# EAGLE design Polarshield v2.4 (EAGLE 7.2.0)
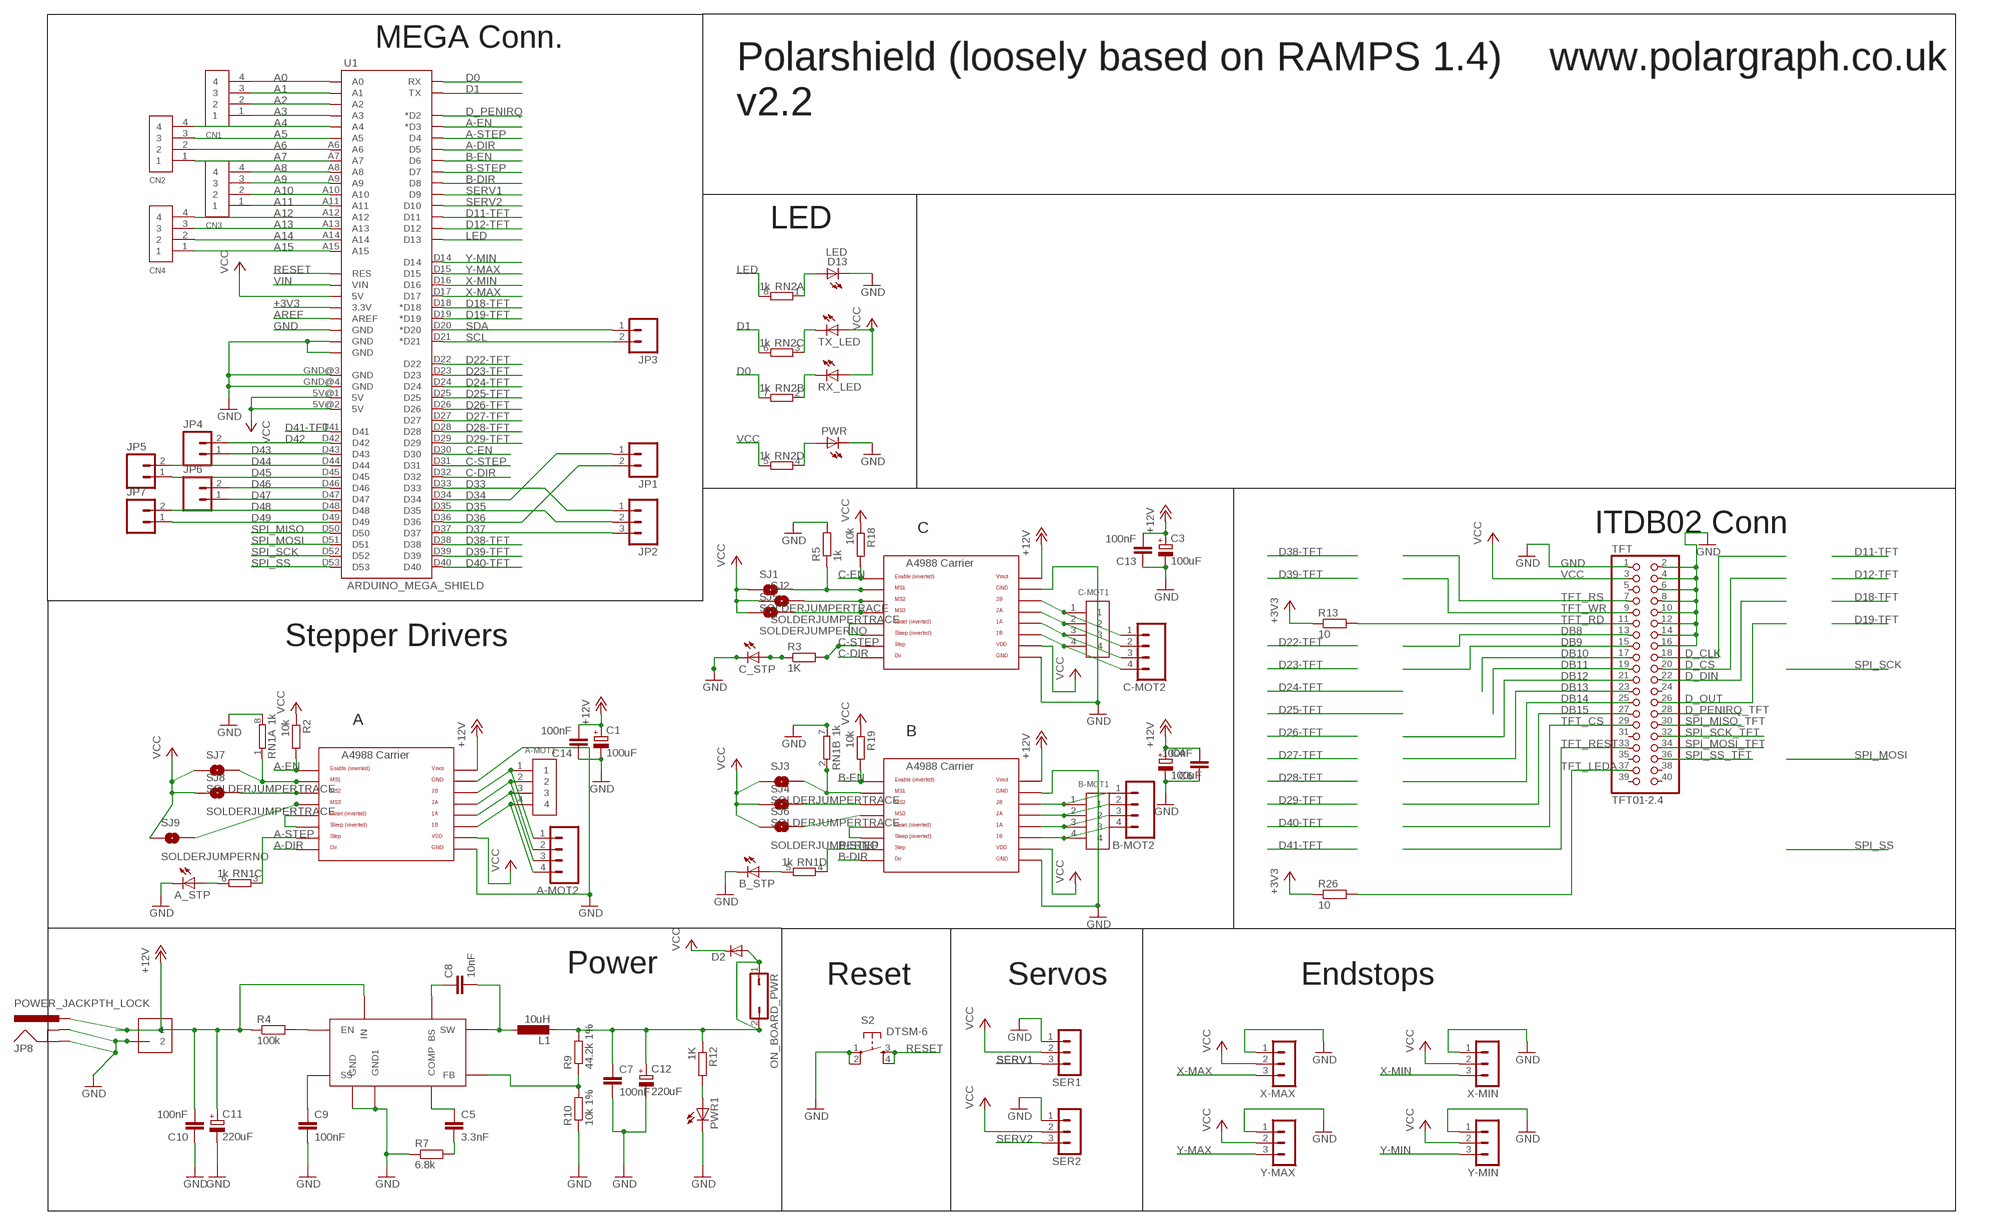
[diagram p0: schematic, sheet 1, part 1 of 2]
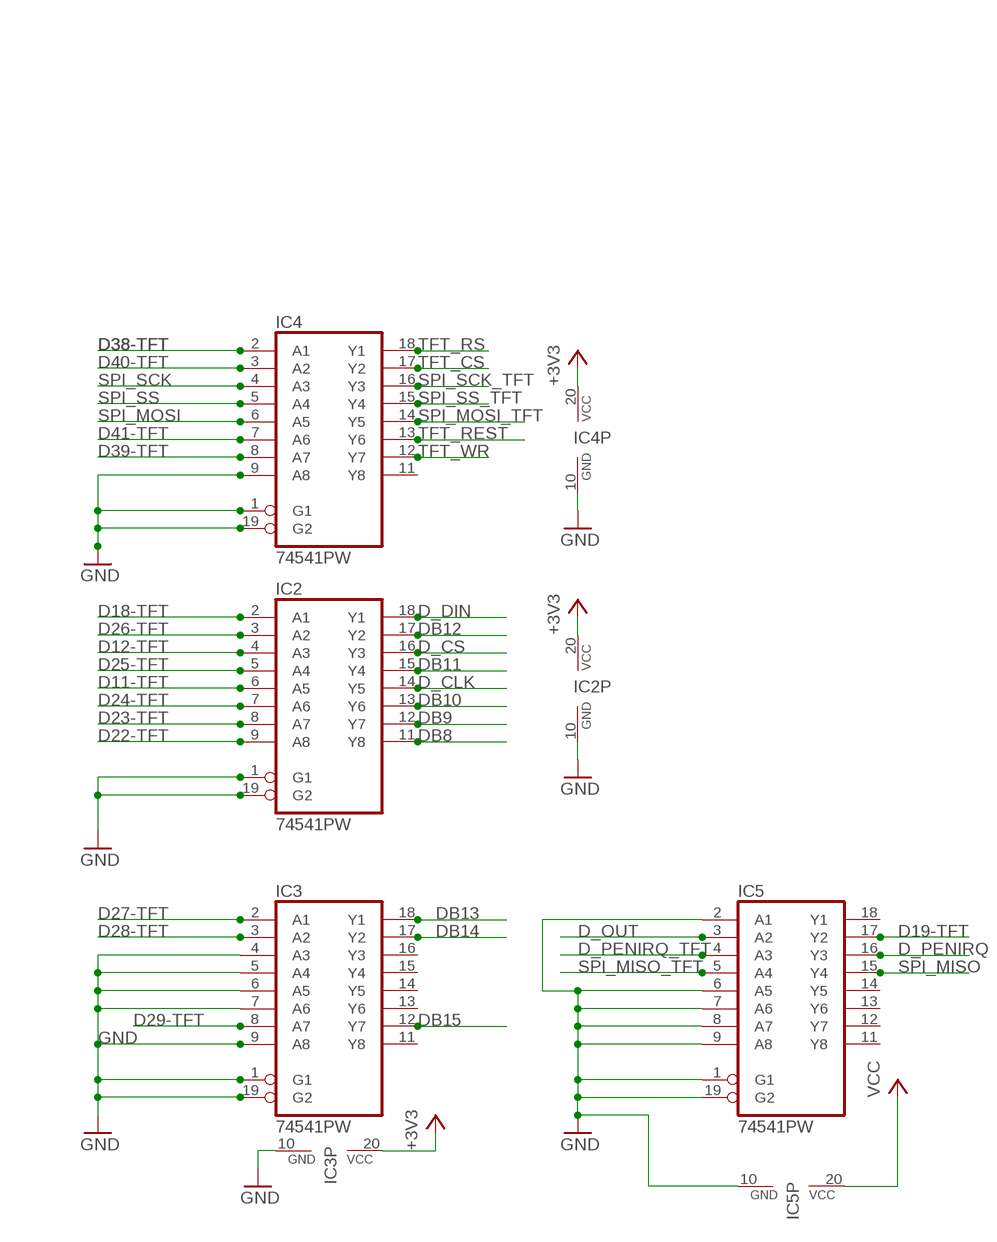
[diagram p1: schematic, sheet 1, part 2 of 2]

## Parts
A-MOT1  1X4-BIG  [1X04-BIG]
A-MOT2  M04SCREW  [SCREWTERMINAL-3.5MM-4]
A_STP  LEDCHIP-LED0805  [CHIP-LED0805]
B-MOT1  1X4-BIG  [1X04-BIG]
B-MOT2  M04SCREW  [SCREWTERMINAL-3.5MM-4]
B_STP  LEDCHIP-LED0805  [CHIP-LED0805]
C1  100uF  CPOL-EU153CLV-0605  [153CLV-0605]
C3  100uF  CPOL-EU153CLV-0605  [153CLV-0605]
C4  100uF  CPOL-EU153CLV-0605  [153CLV-0605]
C5  3.3nF  C-EUC0805K  [C0805K]
C6  100nF  C-EUC0805  [C0805]
C7  100nF  C-EUC0805K  [C0805K]
C8  10nF  C-EUC0805K  [C0805K]
C9  100nF  C-EUC0805K  [C0805K]
C10  100nF  C-EUC0805K  [C0805K]
C11  220uF  CPOL-EU153CLV-0807  [153CLV-0807]
C12  220uF  CPOL-EU153CLV-0807  [153CLV-0807]
C13  100nF  C-EUC0805  [C0805]
C14  100nF  C-EUC0805  [C0805]
C-MOT1  1X4-BIG  [1X04-BIG]
C-MOT2  M04SCREW  [SCREWTERMINAL-3.5MM-4]
C_STP  LEDCHIP-LED0805  [CHIP-LED0805]
CN1  1X4-CLEANBIG  [1X04-CLEANBIG]
CN2  1X4-CLEANBIG  [1X04-CLEANBIG]
CN3  1X4-CLEANBIG  [1X04-CLEANBIG]
CN4  1X4-CLEANBIG  [1X04-CLEANBIG]
D2  DIODE-DO214BA  [DO214BA]
D13  LED  LEDCHIP-LED0805  [CHIP-LED0805]
IC1  MP2307  [SOIC8]
IC2  74541PW  [TSSOP20]
IC3  74541PW  [TSSOP20]
IC4  74541PW  [TSSOP20]
IC5  74541PW  [TSSOP20]
J1  1X2-3.5MM  [1X2-3.5MM]
JP1  M021X02_NO_SILK  [1X02_NO_SILK]
JP2  M031X03_NO_SILK  [1X03_NO_SILK]
JP3  M021X02_NO_SILK  [1X02_NO_SILK]
JP4  M021X02_NO_SILK  [1X02_NO_SILK]
JP5  M021X02_NO_SILK  [1X02_NO_SILK]
JP6  M021X02_NO_SILK  [1X02_NO_SILK]
JP7  M021X02_NO_SILK  [1X02_NO_SILK]
JP8  POWER_JACKPTH_LOCK  [POWER_JACK_PTH_LOCK]
L1  10uH  L-EUPIS2816  [PIS2816]
ON_BOARD_PWR  JP1Q  [JP1]
PWR  LEDCHIP-LED0805  [CHIP-LED0805]
PWR1  LEDCHIP-LED0805  [CHIP-LED0805]
R2  10k  R-EU_R0805  [R0805]
R3  1K  R-EU_R0805  [R0805]
R4  100k  R-EU_R0805  [R0805]
R5  1k  R-EU_R0805  [R0805]
R7  6.8k  R-EU_R0805  [R0805]
R9  44.2k 1%  R-EU_R0805  [R0805]
R10  10k 1%  R-EU_R0805  [R0805]
R12  1K  R-EU_R0805  [R0805]
R13  10  R-EU_R0805  [R0805]
R18  10k  R-EU_R0805  [R0805]
R19  10k  R-EU_R0805  [R0805]
R26  10  R-EU_R0805  [R0805]
RN1  1k  4R-NEXBN8V  [EXBN8V]
RN2  1k  4R-NEXBN8V  [EXBN8V]
RX_LED  LEDCHIP-LED0805  [CHIP-LED0805]
S2  DTSM-6  [DTSM-6]
SER1  3PIN-HEADER  [3PIN-HEADER]
SER2  3PIN-HEADER  [3PIN-HEADER]
SJ1  SOLDERJUMPERTRACE  [SJ_2S-TRACE]
SJ2  SOLDERJUMPERTRACE  [SJ_2S-TRACE]
SJ3  SOLDERJUMPERTRACE  [SJ_2S-TRACE]
SJ4  SOLDERJUMPERTRACE  [SJ_2S-TRACE]
SJ5  SOLDERJUMPERNO  [SJ_2S-NO]
SJ6  SOLDERJUMPERNO  [SJ_2S-NO]
SJ7  SOLDERJUMPERTRACE  [SJ_2S-TRACE]
SJ8  SOLDERJUMPERTRACE  [SJ_2S-TRACE]
SJ9  SOLDERJUMPERNO  [SJ_2S-NO]
TFT  TFT01-2.4  [TFT01-2.4]
TX_LED  LEDCHIP-LED0805  [CHIP-LED0805]
U1  ARDUINO_MEGA_SHIELD  [ARDUINO_MEGA_SHIELD]
U$1  A4988BREAKOUT  [A4988BREAKOUT]
U$6  A4988BREAKOUT  [A4988BREAKOUT]
U$7  A4988BREAKOUT  [A4988BREAKOUT]
X-MAX  3PIN-HEADER  [3PIN-HEADER]
X-MIN  3PIN-HEADER  [3PIN-HEADER]
Y-MAX  3PIN-HEADER  [3PIN-HEADER]
Y-MIN  3PIN-HEADER  [3PIN-HEADER]

## Nets
+3V3: IC2.20(VCC) IC3.20(VCC) IC4.20(VCC) R13.1 R26.1 U1.3.3V
+12V [vmot]: C1.+ C3.+ C4.+ C6.2 C10.2 C11.+ C13.2 C14.2 IC1.IN J1.1 JP8.PWR R4.1 U$1.VMOT U$6.VMOT U$7.VMOT
A0: CN1.4 U1.A0
A1: CN1.3 U1.A1
A2: CN1.2 U1.A2
A3: CN1.1 U1.A3
A4: CN2.4 U1.A4
A5: CN2.3 U1.A5
A6: CN2.2 U1.A6
A7: CN2.1 U1.A7
A8: CN3.4 U1.A8
A9: CN3.3 U1.A9
A10: CN3.2 U1.A10
A11: CN3.1 U1.A11
A12: CN4.4 U1.A12
A13: CN4.3 U1.A13
A14: CN4.2 U1.A14
A15: CN4.1 U1.A15
A-DIR: U1.D5 U$1.DIR
A-EN: R2.2 U1.D3(*D3) U$1.EN
A-STEP: RN1.3 U1.D4 U$1.STEP
AREF: U1.AREF
B-DIR: U1.D8 U$7.DIR
B-EN: R19.2 U1.D6 U$7.EN
B-STEP: RN1.4 U1.D7 U$7.STEP
C-DIR: U1.D32 U$6.DIR
C-EN: R18.2 U1.D30 U$6.EN
C-STEP: R3.2 U1.D31 U$6.STEP
D0: RN2.7 U1.RX
D1: RN2.6 U1.TX
D11-TFT: IC2.6(A5) U1.D11
D12-TFT: IC2.4(A3) U1.D12
D18-TFT: IC2.2(A1) U1.D18(*D18)
D19-TFT [signal]: IC5.17(Y2) U1.D19(*D19)
D22-TFT: IC2.9(A8) U1.D22
D23-TFT: IC2.8(A7) U1.D23
D24-TFT: IC2.7(A6) U1.D24
D25-TFT: IC2.5(A4) U1.D25
D26-TFT: IC2.3(A2) U1.D26
D27-TFT: IC3.2(A1) U1.D27
D28-TFT: IC3.3(A2) U1.D28
D29-TFT: IC3.8(A7) U1.D29
D33: JP2.1 U1.D33
D34: JP1.1 U1.D34
D35: JP2.2 U1.D35
D36: JP1.2 U1.D36
D37: JP2.3 U1.D37
D38-TFT: IC4.2(A1) U1.D38
D39-TFT: IC4.8(A7) U1.D39
D40-TFT: IC4.3(A2) U1.D40
D41-TFT: IC4.7(A6) U1.D41
D42: JP4.2 U1.D42
D43: JP4.1 U1.D43
D44: JP5.2 U1.D44
D45: JP5.1 U1.D45
D46: JP6.2 U1.D46
D47: JP6.1 U1.D47
D48: JP7.2 U1.D48
D49: JP7.1 U1.D49
D_CLK: IC2.14(Y5) TFT.18
D_CS: IC2.16(Y3) TFT.20
D_DIN: IC2.18(Y1) TFT.22
D_OUT: IC5.3(A2) TFT.26
D_PENIRQ: IC5.16(Y3) U1.D2(*D2)
D_PENIRQ_TFT: IC5.4(A3) TFT.28
DB8: IC2.11(Y8) TFT.13
DB9: IC2.12(Y7) TFT.15
DB10: IC2.13(Y6) TFT.17
DB11: IC2.15(Y4) TFT.19
DB12: IC2.17(Y2) TFT.21
DB13: IC3.18(Y1) TFT.23
DB14: IC3.17(Y2) TFT.25
DB15: IC3.12(Y7) TFT.27
GND [gnd5]: A_STP.C B_STP.C C1.- C3.- C4.- C6.1 C7.2 C9.2 C10.1 C11.- C12.- C13.1 C14.1 C_STP.C D13.C IC1.GND IC1.GND1 IC2.1(G1) IC2.10(GND) IC2.19(G2) IC3.1(G1) IC3.4(A3) IC3.5(A4) IC3.6(A5) IC3.7(A6) IC3.9(A8) IC3.10(GND) IC3.19(G2) IC4.1(G1) IC4.9(A8) IC4.10(GND) IC4.19(G2) IC5.1(G1) IC5.2(A1) IC5.6(A5) IC5.7(A6) IC5.8(A7) IC5.9(A8) IC5.10(GND) IC5.19(G2) J1.2 JP8.GND JP8.GNDBREAK PWR1.C PWR.C R5.2 R7.1 R10.1 RN1.7 RN1.8 S2.1 S2.2 SER1.1 SER2.1 TFT.1 TFT.2 TFT.4 TFT.6 TFT.8 TFT.10 TFT.12 TFT.14 TFT.16 U1.GND@0(GND) U1.GND@1(GND) U1.GND@2(GND) U1.GND@3(GND) U1.GND@4(GND) U$1.GND U$1.GND@0(GND) U$6.GND U$6.GND@0(GND) U$7.GND U$7.GND@0(GND) X-MAX.1 X-MIN.1 Y-MAX.1 Y-MIN.1
LED: RN2.8 U1.D13
N$1: U$6.RST U$6.SLP(SLEEP)
N$2: PWR.A RN2.4
N$3: R5.1 SJ1.2 U$6.MS1
N$4: A-MOT1.1 A-MOT2.1 U$1.2B
N$5 [vmot]: A-MOT1.2 A-MOT2.2 U$1.2A
N$6 [vmot]: A-MOT1.3 A-MOT2.3 U$1.1A
N$7: A-MOT1.4 A-MOT2.4 U$1.1B
N$8: U$1.RST U$1.SLP(SLEEP)
N$9: RN1.1 SJ7.2 U$1.MS1
N$10: SJ2.2 U$6.MS2
N$11: SJ8.2 U$1.MS2
N$12: SJ5.2 U$6.MS3
N$13: U$7.RST U$7.SLP(SLEEP)
N$14: SJ9.2 U$1.MS3
N$15: RN2.2 RX_LED.C
N$16: RN2.3 TX_LED.C
N$17: SJ4.2 U$7.MS2
N$18: B_STP.A RN1.5
N$19: A_STP.A RN1.6
N$20: D13.A RN2.1
N$21: C-MOT1.1 C-MOT2.1 U$6.2B
N$22: C-MOT1.2 C-MOT2.2 U$6.2A
N$23: C_STP.A R3.1
N$24: C7.1 C12.+ D2.A L1.2 ON_BOARD_PWR.1 ON_BOARD_PWR.2 R9.2 R12.1
N$25: PWR1.A R12.2
N$26: C-MOT1.3 C-MOT2.3 U$6.1A
N$27: C-MOT1.4 C-MOT2.4 U$6.1B
N$28: B-MOT1.1 B-MOT2.1 U$7.2B
N$29: B-MOT1.2 B-MOT2.2 U$7.2A
N$30: B-MOT1.3 B-MOT2.3 U$7.1A
N$31: SJ6.2 U$7.MS3
N$32: IC1.FB R9.1 R10.2
N$33: RN1.2 SJ3.2 U$7.MS1
N$34: IC1.EN R4.2
N$36: B-MOT1.4 B-MOT2.4 U$7.1B
N$38: C9.1 IC1.SS
N$40: C5.2 R7.2
N$42: C5.1 IC1.COMP
N$43: C8.1 IC1.BS
N$44: C8.2 IC1.SW L1.1
RESET: S2.3 S2.4 U1.RES
SCL: JP3.2 U1.D21(*D21)
SDA: JP3.1 U1.D20(*D20)
SERV1: SER1.3 U1.D9
SERV2: SER2.3 U1.D10
SPI_MISO: IC5.15(Y4) U1.D50
SPI_MISO_TFT: IC5.5(A4) TFT.30
SPI_MOSI: IC4.6(A5) U1.D51
SPI_MOSI_TFT: IC4.14(Y5) TFT.34
SPI_SCK: IC4.4(A3) U1.D52
SPI_SCK_TFT: IC4.16(Y3) TFT.32
SPI_SS: IC4.5(A4) U1.D53
SPI_SS_TFT: IC4.15(Y4) TFT.36
TFT_CS: IC4.17(Y2) TFT.29
TFT_LEDA: R26.2 TFT.37
TFT_RD: R13.2 TFT.11
TFT_REST: IC4.13(Y6) TFT.33
TFT_RS: IC4.18(Y1) TFT.7
TFT_WR: IC4.12(Y7) TFT.9
VCC: D2.C IC5.20(VCC) R2.1 R18.1 R19.1 RN2.5 RX_LED.A SER1.2 SER2.2 SJ1.1 SJ2.1 SJ3.1 SJ4.1 SJ5.1 SJ6.1 SJ7.1 SJ8.1 SJ9.1 TFT.3 TX_LED.A U1.5V@0(5V) U1.5V@1(5V) U1.5V@2(5V) U$1.VDD U$6.VDD U$7.VDD X-MAX.2 X-MIN.2 Y-MAX.2 Y-MIN.2
VIN [vcc]: U1.VIN
X-MAX: U1.D17 X-MAX.3
X-MIN: U1.D16 X-MIN.3
Y-MAX: U1.D15 Y-MAX.3
Y-MIN: U1.D14 Y-MIN.3
Unconnected: IC3.11(Y8) IC3.13(Y6) IC3.14(Y5) IC3.15(Y4) IC3.16(Y3) IC4.11(Y8) IC5.11(Y8) IC5.12(Y7) IC5.13(Y6) IC5.14(Y5) IC5.18(Y1) TFT.5 TFT.24 TFT.31 TFT.35 TFT.38 TFT.39 TFT.40

## Notes on the sheet
- MEGA Conn.
- Polarshield (loosely based on RAMPS 1.4) | www.polargraph.co.uk
- v2.2
- LED
- C | ITDB02 Conn
- Stepper Drivers
- A
- B
- Power
- Reset | Servos | Endstops

## Library data of the parts
A-MOT1 B-MOT1 C-MOT1 = adafruit:1X4: 4-pin connector
A-MOT2 B-MOT2 C-MOT2 = Polarshield v2.0e:M04: Header 4 Standard 4-pin 0.1" header. Use with straight break away headers (SKU : PRT-00116), right angle break away headers (PRT-00553), swiss pins (PRT-00743), machine pins (PRT-00117), and female headers (PRT-00115). Molex polarized connector foot print use with SKU : PRT-08231 with associated crimp pins and housings. 1MM SMD Version SKU: PRT-10208
A_STP B_STP C_STP D13 PWR PWR1 RX_LED TX_LED = led:LED: LED OSRAM: - CHIPLED LG R971, LG N971, LY N971, LG Q971, LY Q971, LO R971, LY R971 LH N974, LH R974 LS Q976, LO Q976, LY Q976 LO Q996 - Hyper CHIPLED LW Q18S LB Q993, LB Q99A, LB R99A - SideLED LS A670, LO A670, LY A670, LG A670, LP A670 LB A673, LV A673, LT A673, LW A673 LH A674 LY A675 LS A676, LA A676, LO A676, LY A676, LW A676 LS A679, LY A679, LG A679 - Hyper Micro SIDELED® LS Y876, LA Y876, LO Y876, LY Y876 LT Y87S - SmartLED LW L88C, LW L88S LB L89C, LB L89S, LG L890 LS L89K, LO L89K, LY L89K LS L896, LA L896, LO L896, LY L896 - TOPLED LS T670, LO T670, LY T670, LG T670, LP T670 LSG T670, LSP T670, LSY T670, LOP T670, LYG T670 LG T671, LOG T671, LSG T671 LB T673, LV T673, LT T673, LW T673 LH T674 LS T676, LA T676, LO T676, LY T676, LB T676, LH T676, LSB T676, LW T676 LB T67C, LV T67C, LT T67C, LS T67K, LO T67K, LY T67K, LW E67C LS E67B, LA E67B, LO E67B, LY E67B, LB E67C, LV E67C, LT E67C LW T67C LS T679, LY T679, LG T679 LS T770, LO T770, LY T770, LG T770, LP T770 LB T773, LV T773, LT T773, LW T773 LH T774 LS E675, LA E675, LY E675, LS T675 LS T776, LA T776, LO T776, LY T776, LB T776 LHGB T686 LT T68C, LB T68C - Hyper Mini TOPLED® LB M676 - Mini TOPLED Santana® LG M470 LS M47K, LO M47K, LY M47K Source: http://www.osram.convergy.de LUXEON: - LUMILED® LXK2-PW12-R00, LXK2-PW12-S00, LXK2-PW14-U00, LXK2-PW14-V00 LXK2-PM12-R00, LXK2-PM12-S00, LXK2-PM14-U00 LXK2-PE12-Q00, LXK2-PE12-R00, LXK2-PE12-S00, LXK2-PE14-T00, LXK2-PE14-U00 LXK2-PB12-K00, LXK2-PB12-L00, LXK2-PB12-M00, LXK2-PB14-N00, LXK2-PB14-P00, LXK2-PB14-Q00 LXK2-PR12-L00, LXK2-PR12-M00, LXK2-PR14-Q00, LXK2-PR14-R00 LXK2-PD12-Q00, LXK2-PD12-R00, LXK2-PD12-S00 LXK2-PH12-R00, LXK2-PH12-S00 LXK2-PL12-P00, LXK2-PL12-Q00, LXK2-PL12-R00 Source: www.luxeon.com KINGBRIGHT: KA-3528ASYC Source: www.kingbright.com
C1 C3 C4 = rcl:CPOL-EU: POLARIZED CAPACITOR, European symbol
C5-C10 C13 C14 = resistor:C-EU: CAPACITOR, European symbol
C11 C12 = resistor:CPOL-EU: POLARIZED CAPACITOR, European symbol
CN1-CN4 = Polarshield v2.0e:1X4: 4-pin connector
D2 = diode:DIODE-: DIODE
IC1 = sandy:MP2307
IC2-IC5 = 74xx-eu:74*541: Octal BUFFER and LINE DRIVER, 3-state
J1 = adafruit:1X2: 3.5mm Terminal block http://www.ladyada.net/library/pcb/eaglelibrary.html
JP1 JP3-JP7 = SparkFun-Connectors:M02: Standard 2-pin 0.1" header. Use with - straight break away headers ( PRT-00116) - right angle break away headers (PRT-00553) - swiss pins (PRT-00743) - machine pins (PRT-00117) - female headers (PRT-00115) Molex polarized connector foot print use with: PRT-08233 with associated crimp pins and housings. 2.54_SCREWTERM for use with PRT-10571. 3.5mm Screw Terminal footprints for PRT-08084 5mm Screw Terminal footprints for use with PRT-08432
JP2 = SparkFun-Connectors:M03: Header 3 Standard 3-pin 0.1" header. Use with straight break away headers (SKU : PRT-00116), right angle break away headers (PRT-00553), swiss pins (PRT-00743), machine pins (PRT-00117), and female headers (PRT-00115). Molex polarized connector foot print use with SKU : PRT-08232 with associated crimp pins and housings.
JP8 = SparkFun-Connectors:POWER_JACK: Power Jack This is the standard 5.5mm barrel jack for power. The PTH is the most common, proven, reliable, footprint. The Slot footprint only works if the mill layer is transmitted to the PCB fab house so be warned. Mating wall wart : TOL-00298 (and others); PROD_ID: CONN-08197; SF_ID: PRT-00119
L1 = rcl:L-EU: INDUCTOR, European symbol
ON_BOARD_PWR = jumper:JP1Q: JUMPER
R2 R3 R5 R12 R18 R19 = rcl:R-EU_: RESISTOR, European symbol
R4 R7 R9 R10 R13 R26 = resistor:R-EU_: RESISTOR, European symbol
RN1 RN2 = resistor-dil:4R-N: Array Chip Resistor Source: RS Component / Phycomp; OC_FARNELL: unknown; OC_NEWARK: unknown
S2 = switch-tact:DTSM-6
SER1 SER2 X-MAX X-MIN Y-MAX Y-MIN = ultimachine:3PIN-HEADER: PIN HEADER
SJ1-SJ9 = SparkFun:SOLDERJUMPER: Solder Jumper Standard SMD solder jumper. Used to automate production. Two varients : Normally Open and Normally Closed are the same, but have different paste layers. NC will have a large amount of paste and should jumper during reflow.
TFT = Polarshield v2.0e:TFT01-2.4
U1 = Polarshield v2.0e:ARDUINO_MEGA_SHIELD
U$1 U$6 U$7 = RepRapjr:A4988BREAKOUT

## Net classes
0 default: width 0.406 mm
1 gnd12: width 1.422 mm
2 gnd5: width 1.422 mm
3 vmot: width 1.422 mm
4 vcc: width 0.61 mm
5 signal: width 0.406 mm

## Board
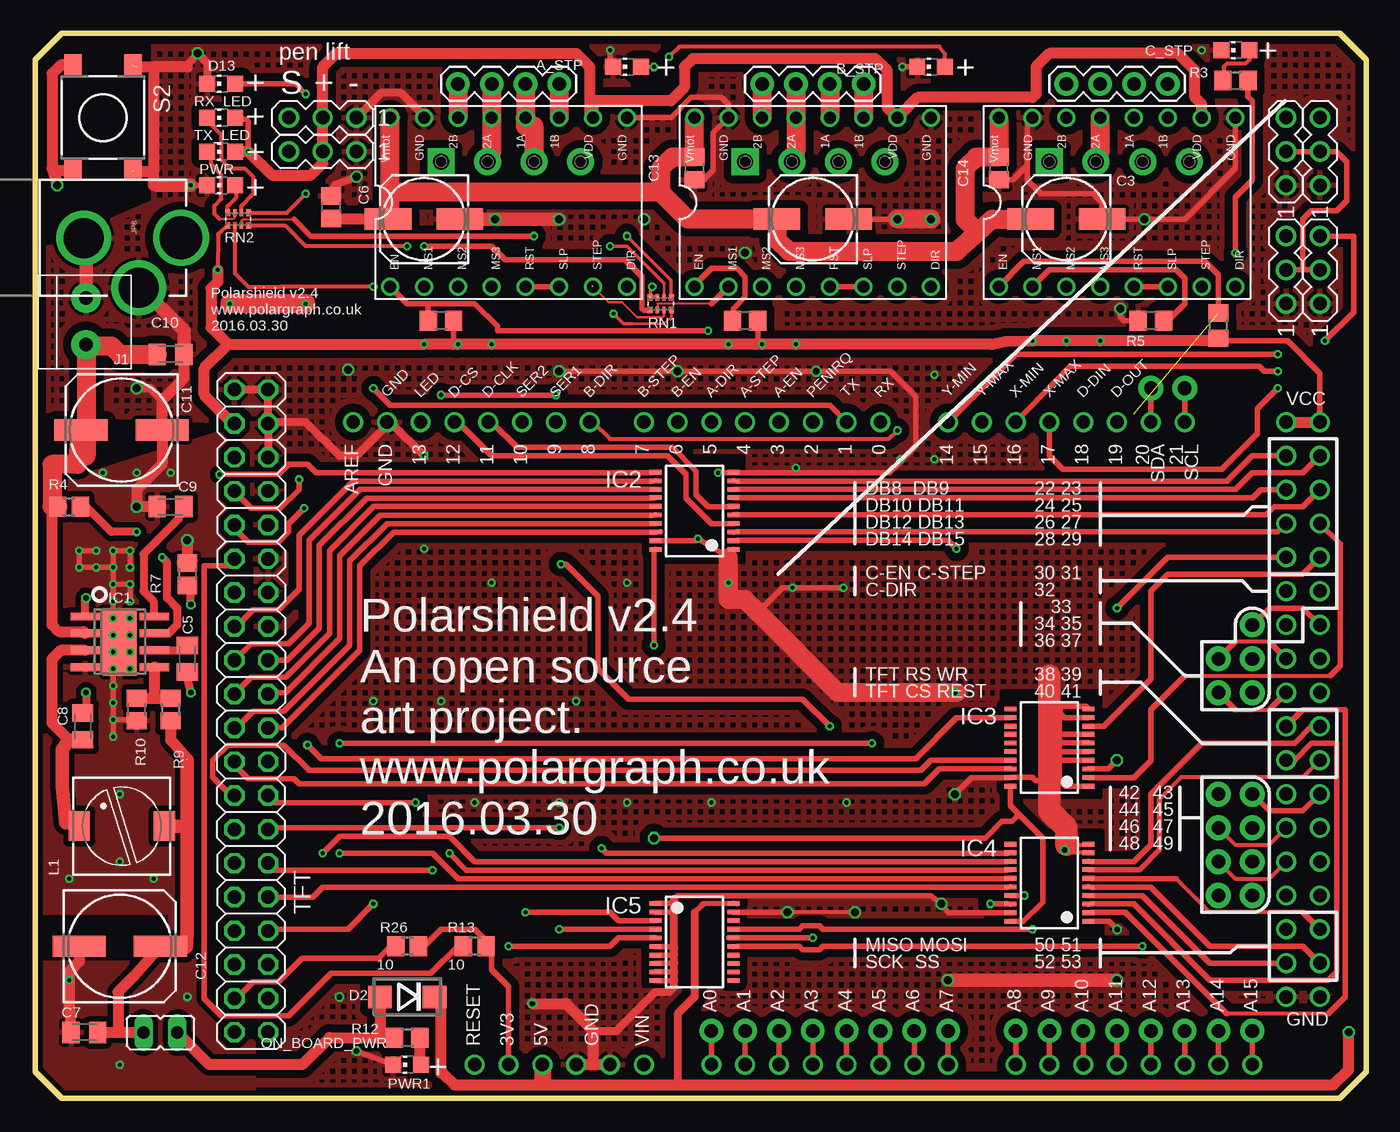
[diagram p2: board, top side]
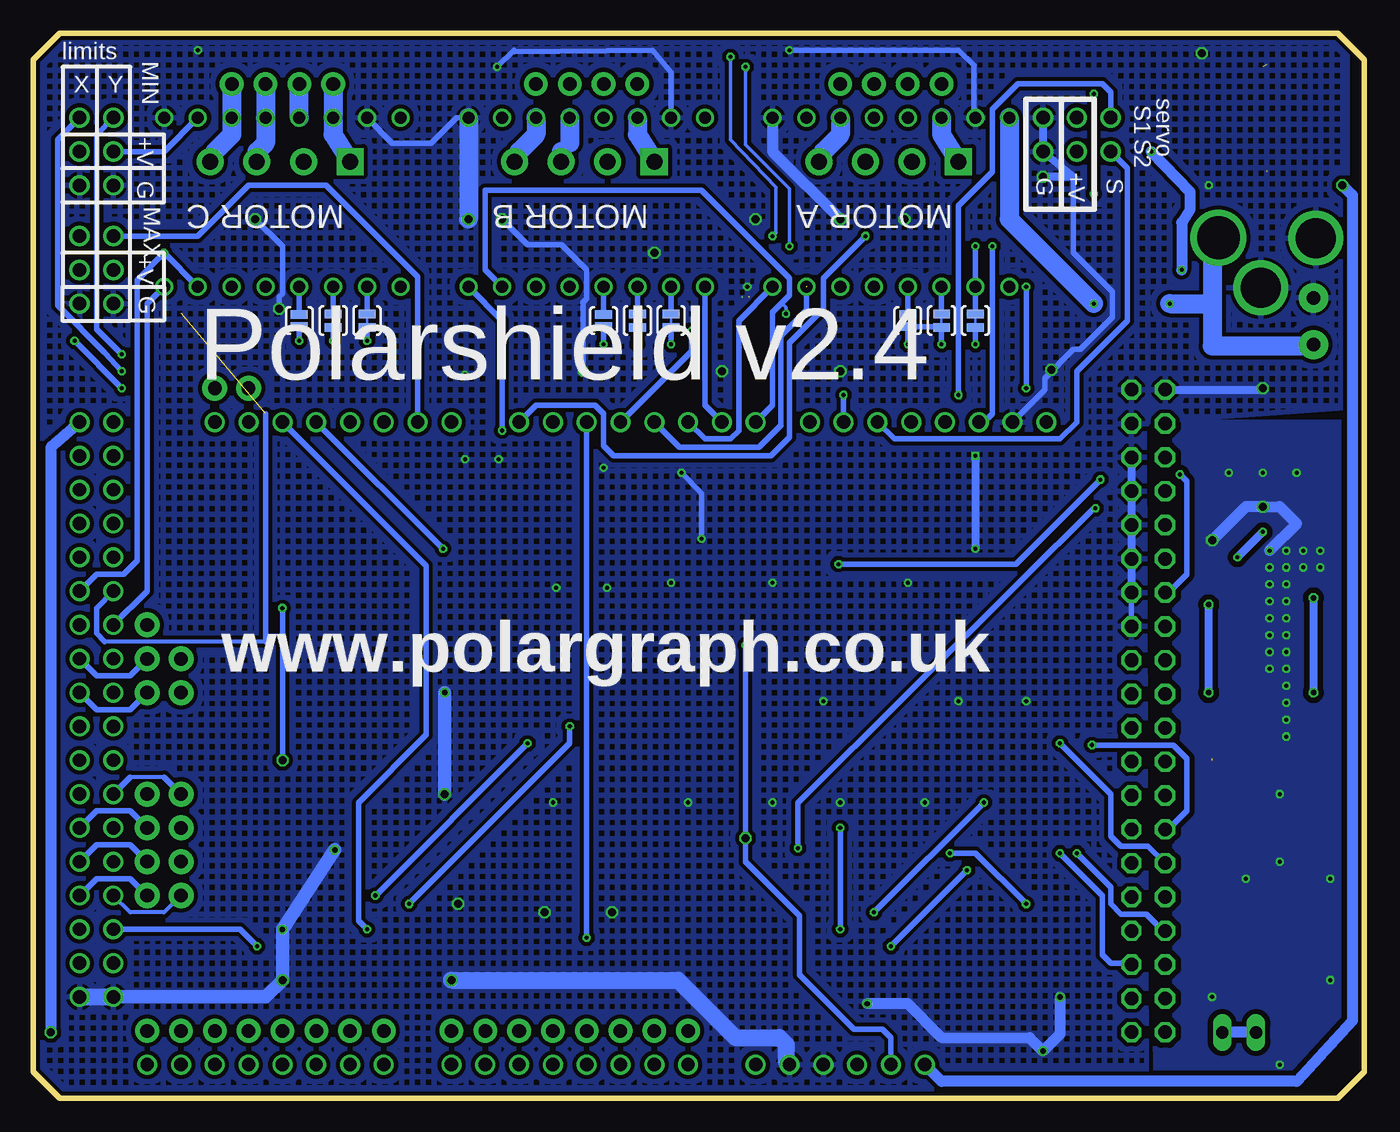
[diagram p3: board, bottom side, seen from below]

Size 100 x 80 mm. Coordinates in mm from the lower left corner, seen from the top.
Outline: 0,2 2,0 98,0 100,2 100,78 98,80 2,80 0,78
Outline: 0,2.03 0,77.98
Copper layers (1*2*15*16): Top 0.035mm / dielectric 0.2mm / Route2 0.0175mm / dielectric 1.1mm / Route15 0.0175mm / dielectric 0.2mm / Bottom 0.035mm
Design rules "SeeedStudio_DRU_no_angle_20130527": minimum track width 6mil, minimum drill 12mil, track to track 6mil, track to pad 6mil, pad to pad 6mil, via to via 6mil, smd to smd 0mil, copper to edge 10mil, drill to drill 10mil, minimum pad ring 6mil, minimum via ring 6mil, stop-mask expansion 2mil, vias tented up to drill 25mil, thermal gap 10mil

### Footprints (pad centres in the part's own frame; a part is rotated, then mirrored left to right if it is on the bottom)
1X04-BIG = drill 1.016 pad 1.778: 1 0,0; 2 2.54,0; 3 5.08,0; 4 7.62,0
SCREWTERMINAL-3.5MM-4 = drill 1.2 pad 2.032 square: 1 0,0 | drill 1.2 pad 2.032: 2 3.5,0; 3 7,0; 4 10.5,0
CHIP-LED0805 = smd 1.2 x 1.2: A 0,-1.05; C 0,1.05
153CLV-0605 = smd 3.5 x 1.6: + 2.7,0; - -2.7,0
C0805K = smd 1.3 x 1.6: 1 -1,0; 2 1,0
C0805 = smd 1.3 x 1.5: 1 -0.85,0; 2 0.85,0
153CLV-0807 = smd 4 x 1.6: + 3.05,0; - -3.05,0
1X04-CLEANBIG = drill 1.016 pad 1.778: 1 -3.81,0; 2 -1.27,0; 3 1.27,0; 4 3.81,0
DO214BA = smd 1.8 x 1.7: A 2.05,0; C -2.05,0
SOIC8 = smd 0.6 x 2.2: BS -1.905,-2.6; COMP 0.635,2.6; EN -0.635,2.6; FB 1.905,2.6; GND 1.905,-2.6; IN -0.635,-2.6; SS -1.905,2.6; SW 0.635,-2.6 | smd 5.08 x 2.54: GND1 0,0
TSSOP20 = smd 0.35 x 0.9: 1 -1.95,-2.925; 2 -1.3,-2.925; 3 -0.65,-2.925; 4 0,-2.925; 5 0.65,-2.925; 6 1.3,-2.925; 7 1.95,-2.925; 8 2.555,-2.925; 9 3.205,-2.925; 10 3.855,-2.925; 11 3.855,2.925; 12 3.205,2.925; 13 2.555,2.925; 14 1.95,2.925; 15 1.3,2.925; 16 0.65,2.925; 17 0,2.925; 18 -0.65,2.925; 19 -1.3,2.925; 20 -1.95,2.925
1X2-3.5MM = drill 1 pad 2.184: 1 1.8,0; 2 -1.7,0
1X02_NO_SILK = drill 1.016 pad 1.88: 1 0,0; 2 2.54,0
1X03_NO_SILK = drill 1.016 pad 1.88: 1 0,0; 2 2.54,0; 3 5.08,0
POWER_JACK_PTH_LOCK = drill 2.997 pad 4.115: GND 0.025,6.557; GNDBREAK 3.762,10.7 | drill 3.2 pad 4.115: PWR 0,13.878
PIS2816 = smd 2.2 x 1.6: 1 0,3.2; 2 0,-3.2
JP1 = drill 0.914 long: 1 0,-1.27; 2 0,1.27
R0805 = smd 1.3 x 1.5: 1 -0.95,0; 2 0.95,0
R0805' = smd 1.3 x 1.5: 1 -0.85,0; 2 0.85,0
EXBN8V = smd 0.38 x 0.5: 1 -0.8,-0.475; 4 0.8,-0.475; 5 0.8,0.475; 8 -0.8,0.475 | smd 0.25 x 0.5: 2 -0.25,-0.475; 3 0.25,-0.475; 6 0.25,0.475; 7 -0.25,0.475
DTSM-6 = smd 1.55 x 1.3: 1 -3.975,2.25; 2 3.975,2.25; 3 -3.975,-2.25; 4 3.975,-2.25
3PIN-HEADER = drill 1.016: 1 -2.54,0; 2 0,0; 3 2.54,0
SJ_2S-TRACE = smd 0.635 x 1.27: 1 -0.508,0; 2 0.508,0
SJ_2S-NO = smd 0.635 x 1.27: 1 -0.45,0; 2 0.45,0
TFT01-2.4 = drill 1.016 octagon: 1 0.98,24.02; 2 3.52,24.02; 3 0.98,21.48; 4 3.52,21.48; 5 0.98,18.94; 6 3.52,18.94; 7 0.98,16.4; 8 3.52,16.4; 9 0.98,13.86; 10 3.52,13.86; 11 0.98,11.32; 12 3.52,11.32; 13 0.98,8.78; 14 3.52,8.78; 15 0.98,6.24; 16 3.52,6.24; 17 0.98,3.7; 18 3.52,3.7; 19 0.98,1.16; 20 3.52,1.16; 21 0.98,-1.38; 22 3.52,-1.38; 23 0.98,-3.92; 24 3.52,-3.92; 25 0.98,-6.46; 26 3.52,-6.46; 27 0.98,-9; 28 3.52,-9; 29 0.98,-11.54; 30 3.52,-11.54; 31 0.98,-14.08; 32 3.52,-14.08; 33 0.98,-16.62; 34 3.52,-16.62; 35 0.98,-19.16; 36 3.52,-19.16; 37 0.98,-21.7; 38 3.52,-21.7; 39 0.98,-24.24; 40 3.52,-24.24
ARDUINO_MEGA_SHIELD = drill 1 pad 1.422: 3.3V 50.8,26.67; 5V@0 50.8,29.21; 5V@1 2.54,85.09; 5V@2 2.54,87.63; A0 50.8,41.91; A1 50.8,44.45; A2 50.8,46.99; A3 50.8,49.53; A4 50.8,52.07; A5 50.8,54.61; A6 50.8,57.15; A7 50.8,59.69; A8 50.8,64.77; A9 50.8,67.31; A10 50.8,69.85; A11 50.8,72.39; A12 50.8,74.93; A13 50.8,77.47; A14 50.8,80.01; A15 50.8,82.55; AREF 2.54,14.986; D2 2.54,49.53; D3 2.54,46.99; D4 2.54,44.45; D5 2.54,41.91; D6 2.54,39.37; D7 2.54,36.83; D8 2.54,32.766; D9 2.54,30.226; D10 2.54,27.686; D11 2.54,25.146; D12 2.54,22.606; D13 2.54,20.066; D14 2.54,59.69; D15 2.54,62.23; D16 2.54,64.77; D17 2.54,67.31; D18 2.54,69.85; D19 2.54,72.39; D20 2.54,74.93; D21 2.54,77.47; D22 5.08,85.09; D23 5.08,87.63; D24 7.62,85.09; D25 7.62,87.63; D26 10.16,85.09; D27 10.16,87.63; D28 12.7,85.09; D29 12.7,87.63; D30 15.24,85.09; D31 15.24,87.63; D32 17.78,85.09; D33 17.78,87.63; D34 20.32,85.09; D35 20.32,87.63; D36 22.86,85.09; D37 22.86,87.63; D38 25.4,85.09; D39 25.4,87.63; D40 27.94,85.09; D41 27.94,87.63; D42 30.48,85.09; D43 30.48,87.63; D44 33.02,85.09; D45 33.02,87.63; D46 35.56,85.09; D47 35.56,87.63; D48 38.1,85.09; D49 38.1,87.63; D50 40.64,85.09; D51 40.64,87.63; D52 43.18,85.09; D53 43.18,87.63; GND@0 50.8,31.75; GND@1 50.8,34.29; GND@2 2.54,17.526; GND@3 45.72,85.09; GND@4 45.72,87.63; RES 50.8,24.13; RX 2.54,54.61; TX 2.54,52.07; VIN 50.8,36.83
A4988BREAKOUT = drill 0.9: 1A 8.89,1.27; 1B 11.43,1.27; 2A 6.35,1.27; 2B 3.81,1.27; DIR 16.51,-11.43; EN -1.27,-11.43; GND 16.51,1.27; GND@0 1.27,1.27; MS1 1.27,-11.43; MS2 3.81,-11.43; MS3 6.35,-11.43; RST 8.89,-11.43; SLP 11.43,-11.43; STEP 13.97,-11.43; VDD 13.97,1.27; VMOT -1.27,1.27

### Placement (x,y rotation side)
A-MOT1  31.75,76.2 0 top
A-MOT2  30.48,70.36 0 top
A_STP  44.45,77.47 90 top
B-MOT1  54.61,76.2 0 top
B-MOT2  53.34,70.36 0 top
B_STP  67.31,77.47 90 top
C1  29.21,66.04 180 top
C3  77.47,66.04 180 top
C4  58.42,66.04 180 top
C5  11.43,33.02 270 top
C6  22.23,66.93 270 top
C7  3.68,4.95 180 top
C8  3.56,27.94 270 top
C9  10.16,44.45 180 top
C10  10.16,55.88 180 top
C11  6.48,50.2 180 top
C12  6.35,11.43 0 top
C13  49.53,69.85 90 top
C14  72.39,69.85 90 top
C-MOT1  77.47,76.2 0 top
C-MOT2  76.2,70.36 0 top
C_STP  90.17,78.74 90 top
CN1  54.61,5.08 180 top
CN2  64.77,5.08 180 top
CN3  77.47,5.08 180 top
CN4  87.63,5.08 180 top
D2  27.94,7.62 180 top
D13  13.97,76.2 90 top
IC1  6.35,34.29 270 top
IC2  49.53,43.18 90 top
IC3  76.2,25.4 90 top
IC4  76.2,15.24 90 top
IC5  49.53,12.7 270 top
J1  3.81,58.42 270 top
JP1  88.9,33.02 270 top
JP2  91.44,35.56 270 top
JP3  83.82,53.34 0 top
JP4  91.44,22.86 180 top
JP5  91.44,20.32 180 top
JP6  91.44,17.78 180 top
JP7  91.44,15.24 180 top
JP8  -2.92,64.64 270 top
L1  6.5,20.45 90 top
ON_BOARD_PWR  9.4,4.95 90 top
PWR  13.97,68.58 90 top
PWR1  27.94,2.54 90 top
R2  30.48,58.42 180 top
R3  90.17,76.45 0 top
R4  100k  [R0805']  2.54,44.45 0 top
R5  83.82,58.42 180 top
R7  6.8k  [R0805']  11.43,39.37 270 top
R9  44.2k 1%  [R0805']  10.16,29.21 270 top
R10  10k 1%  [R0805']  7.62,29.21 90 top
R12  27.94,4.57 0 top
R13  10  [R0805']  33.02,11.43 180 top
R18  88.9,58.04 90 top
R19  53.34,58.42 180 top
R26  10  [R0805']  27.94,11.43 180 top
RN1  46.99,59.69 0 top
RN2  15.24,66.04 180 top
RX_LED  13.97,73.66 90 top
S2  5.08,73.66 270 top
SER1  21.59,73.66 180 top
SER2  21.59,71.12 180 top
SJ1  74.93,58.42 90 bottom
SJ2  77.47,58.42 90 bottom
SJ3  52.07,58.42 90 bottom
SJ4  54.61,58.42 90 bottom
SJ5  80.01,58.42 90 bottom
SJ6  57.15,58.42 90 bottom
SJ7  29.21,58.42 90 bottom
SJ8  31.75,58.42 90 bottom
SJ9  34.29,58.42 90 bottom
TFT  13.97,29.21 0 top
TX_LED  13.97,71.12 90 top
U1  8.89,53.34 270 top
U$1  27.94,72.39 0 top
U$6  73.66,72.39 0 top
U$7  50.8,72.39 0 top
X-MAX  96.52,62.23 90 top
X-MIN  96.52,71.12 90 top
Y-MAX  93.98,62.23 90 top
Y-MIN  93.98,71.12 90 top

### Tracks (layer width: path | path; a pad name or v marks a point on that pad's centre or on a via)
+3V3  (via drill 0.3, 0.6)
  Top 0.406: 34.29,11.43 33.02,12.7 30.48,12.7 29.21,11.43 R26.1 | 34.29,11.43 34.29,9.65 35.56,8.38 U1.3.3V | 34.29,11.43 R13.1 | IC3.20 73.28,21.98 73.91,21.34 | 73.91,21.34 75.69,19.56 75.69,14.73 74.25,13.29 IC4.20 | v46.48,34.04 46.48,41.11 IC2.20 | v46.48,19.56 71.37,19.56 72.64,20.83 73.41,20.83 73.91,21.34
  Bottom 0.406: v46.48,34.04 v46.48,19.56 46.48,17.78 42.42,13.72 42.42,9.27 38.35,5.21 36.2,5.21 35.56,4.57 U1.3.3V
+12V  (via drill 0.3)
  Top 0.813: IC1.IN 3.62,35.05 1.78,35.05 1.27,35.56 1.27,44.03 R4.1 | C6.2 26.47,66.08 C1.+
  Top 1.422: R4.1 1.27,44.45 1.27,47.62 3.17,47.62 C11.+ 3.81,48.26 J1.1 3.81,56.52 5.71,56.52 6.35,55.88 C10.2 | 26.67,68.07 26.67,66.04 C1.+ | 26.67,68.07 U$1.VMOT | v20.32,59.69 v14.61,59.69 | 46.99,68.07 26.67,68.07 | U$7.VMOT C13.2 47.84,70.7 46.99,69.85 46.99,68.07 | U$6.VMOT C14.2 70.7,70.7 69.85,69.85 69.85,66.02 70.81,65.06 | 70.81,65.06 69.22,63.63 56.64,63.63 55.72,64.48 C4.+ 49.02,66.04 46.99,68.07 | 70.81,65.06 71.88,66.04 C3.+
  Bottom 0.406: 10.79,64.77 10.83,64.77 JP8.PWR
  Bottom 1.422: 11.43,59.69 11.43,64.14 10.79,64.77 | 11.43,59.69 11.43,56.52 3.81,56.52 J1.1 | v20.32,59.69 26.67,66.04 U$1.VMOT | v14.61,59.69 11.43,59.69
A0
  Top 0.406: U1.A0 CN1.4
A1
  Top 0.406: U1.A1 CN1.3
A2
  Top 0.406: CN1.2 U1.A2
A3
  Top 0.406: CN1.1 U1.A3
A4
  Top 0.406: CN2.4 U1.A4
A5
  Top 0.406: CN2.3 U1.A5
A6
  Top 0.406: CN2.2 U1.A6
A7
  Top 0.406: CN2.1 U1.A7
A8
  Top 0.406: U1.A8 CN3.4
A9
  Top 0.406: CN3.3 U1.A9
A10
  Top 0.406: CN3.2 U1.A10
A11
  Top 0.406: CN3.1 U1.A11
A12
  Top 0.406: CN4.4 U1.A12
A13
  Top 0.406: CN4.3 U1.A13
A14
  Top 0.406: CN4.2 U1.A14
A15
  Top 0.406: CN4.1 U1.A15
A-DIR
  Bottom 0.406: U$1.DIR 46.99,58.42 46.99,50.16 47.62,49.53 49.53,49.53 U1.D5
A-EN  (via drill 0.3)
  Top 0.406: v50.55,57.66 34.73,57.66 34.73,57.98 33.02,59.69 29.46,59.69 | 29.46,59.69 27.94,59.69 U$1.EN | R2.2 29.53,59.62 29.46,59.69
  Bottom 0.406: U1.D3 50.55,56.13 v50.55,57.66
A-STEP  (1 unrouted)
  Top 0.203: RN1.3 47.24,58.8 47.12,58.67 45.21,58.67 44.07,59.82 43.05,59.82 41.85,61.02
  Bottom 0.406: U1.D4 51.44,48.9 45.47,48.9 43.81,50.55 43.81,57.28 41.91,59.18 U$1.STEP
B-DIR  (via drill 0.3)
  Top 0.305: v64.77,50.16 64.14,49.53 43.18,49.53 41.91,50.8 U1.D8
  Bottom 0.406: U$7.DIR 64.77,58.42 v64.77,50.16
B-EN
  Top 0.406: U$7.EN 49.53,61.09 50.8,62.36 52.7,62.36 53.34,61.72 53.34,60.2 52.45,59.31 52.45,58.48 R19.2
  Bottom 0.406: U1.D6 49.53,52.07 U$7.EN
B-STEP  (via drill 0.3)
  Top 0.203: RN1.4 47.79,58.71 47.24,58.17 44.83,58.17
  Top 0.254: 44.83,58.17 44.2,58.17 v43.43,58.93
  Bottom 0.254: v43.43,58.93 43.43,59.44 43.75,59.75
  Bottom 0.406: U$7.STEP 66.04,62.23 66.04,68.2 49.78,68.2 43.18,61.59 43.18,60.33 43.75,59.75 44.45,59.05 44.45,52.07 U1.D7
C-DIR
  Bottom 0.406: U$6.DIR 91.44,59.69 91.44,38.1 U1.D32
C-EN  (1 unrouted)
  Top 0.406: U$6.EN 74.3,62.87 87.88,62.87 88.9,61.85 R18.2
  Bottom 0.305: 82.55,34.29 94.61,34.29
  Bottom 0.406: U1.D30 95.25,36.83 95.25,34.92 94.61,34.29 | 82.55,51.44 82.55,34.29
C-STEP  (via drill 0.3)
  Top 0.406: v90.17,63.5 90.17,67.69 91.44,68.96 91.44,74.93 91.12,75.25 R3.2
  Bottom 0.406: U$6.STEP v90.17,63.5 92.2,61.47 92.2,40.39 93.22,39.37 95.25,39.37 U1.D31
D0  (via drill 0.3)
  Top 0.152: 15.49,65.91 15.62,66.04 19.43,66.04
  Top 0.203: RN2.7 15.49,65.91
  Top 0.406: v37.47,64.77 20.7,64.77 19.43,66.04
  Bottom 0.406: v37.47,64.77 40.64,61.59 40.64,59.31 43.18,56.77 43.18,49.66 44.58,48.26 56.39,48.26 57.15,49.02 57.15,51.44 57.78,52.07 62.23,52.07 U1.RX
D1  (via drill 0.3)
  Top 0.305: v25.4,60.96 18.41,60.96 16,60.96 14.99,61.97 RN2.6
  Top 0.406: U1.TX 59.69,52.07 26.67,52.07 v25.4,53.34
  Bottom 0.406: v25.4,53.34 v25.4,60.96
D11-TFT
  Top 0.406: U1.D11 34.29,50.8 36.2,48.9 47.88,48.9 49.66,47.12 49.66,45.34 50.55,44.45 52.42,44.45 IC2.6
D12-TFT
  Top 0.406: IC2.4 50.8,43.18 48.9,45.09 48.9,46.86 47.5,48.26 34.29,48.26 31.75,50.8 U1.D12
D18-TFT  (via drill 0.3)
  Top 0.406: v69.22,41.27 68.58,41.91 52.7,41.91 IC2.2
  Bottom 0.406: v69.22,41.27 U1.D18
D19-TFT  (via drill 0.3)
  Top 0.406: v74.93,12.7 59.18,12.7 58.93,12.95 57.66,12.95 57.4,12.7 IC5.17
  Bottom 0.406: v74.93,12.7 75.56,13.34 75.56,22.23 70.48,27.3 70.48,40.01 U1.D19
D22-TFT
  Top 0.406: U1.D22 91.44,48.26 89.53,46.35 52.7,46.35 IC2.9
D23-TFT
  Top 0.406: IC2.8 90.19,45.73 91.44,46.99 95.25,46.99 U1.D23
D24-TFT
  Top 0.406: U1.D24 92.08,45.72 91.48,45.13 IC2.7
D25-TFT
  Top 0.406: IC2.5 92.47,43.83 93.09,44.45 95.25,44.45 U1.D25
D26-TFT
  Top 0.406: U1.D26 93.34,42.55 52.7,42.55 IC2.3
D27-TFT
  Top 0.305: 86.36,31.75 97.28,31.75
  Top 0.406: 97.28,31.75 98.04,32.51 98.04,41.66 U1.D27 | IC3.2 82.55,24.1 83.82,25.37 83.82,29.21 86.36,31.75
D28-TFT  (via drill 0.3, 0.6)
  Top 0.406: v81.28,36.83 85.09,40.64 U1.D28 | v81.28,25.4 80.63,24.75 IC3.3
  Bottom 0.406: v81.28,36.83 v81.28,25.4
D29-TFT
  Top 0.406: U1.D29 95.25,39.37 85.09,39.37 83.82,38.1 83.82,31.5 80.28,27.95 IC3.8
D33
  Top 0.406: U1.D33 95.25,36.83 92.71,36.83 JP2.1
D34
  Top 0.305: 92.71,34.29 90.17,34.29
  Top 0.406: U1.D34 92.71,34.29 | 90.17,34.29 JP1.1
D35
  Bottom 0.406: U1.D35 95.25,31.75 92.71,31.75 JP2.2
D36
  Top 0.305: 90.17,29.21 92.71,29.21
  Top 0.406: JP1.2 90.17,29.21 | 92.71,29.21 U1.D36
D37
  Bottom 0.406: U1.D37 95.25,29.21 92.71,29.21 JP2.3
D38-TFT
  Top 0.305: 97.16,6.35 89.53,6.35
  Top 0.406: 97.16,6.35 98.42,7.62 98.42,29.21 95.25,29.21 U1.D38 | 89.53,6.35 81.92,13.97 79.38,13.97 IC4.2
D39-TFT
  Top 0.406: U1.D39 95.89,27.94 94.61,26.67 87.63,26.67 83.82,22.86 83.82,19.05 82.55,17.78 79.38,17.78 IC4.8
D40-TFT
  Top 0.406: U1.D40 94.61,25.4 95.89,26.67 97.79,26.67 97.79,9.53 97.16,8.89 88.27,8.89 82.55,14.61 79.38,14.61 IC4.3
D41-TFT
  Top 0.305: U1.D41 95.25,24.13 86.11,24.13 84.45,22.48
  Top 0.406: IC4.7 82.98,17.19 84.45,18.67 84.45,22.48
D42
  Bottom 0.305: 90.17,24.13 92.71,24.13
  Bottom 0.406: JP4.2 90.17,24.13 | 92.71,24.13 U1.D42
D43
  Top 0.406: JP4.1 92.71,21.59 95.25,21.59 U1.D43
D44
  Top 0.305: JP5.2 90.17,19.05 92.71,19.05 U1.D44
D45
  Bottom 0.406: U1.D45 95.25,21.59 92.71,21.59 JP5.1
D46
  Top 0.305: JP6.2 90.17,16.51 92.71,16.51 U1.D46
D47
  Bottom 0.406: U1.D47 95.25,19.05 92.71,19.05 JP6.1
D48
  Bottom 0.305: JP7.2 90.17,13.97 92.71,13.97 U1.D48
D49
  Bottom 0.406: U1.D49 95.25,16.51 92.71,16.51 JP7.1
D_CLK
  Top 0.305: 17.6,32.89 TFT.18
  Top 0.406: IC2.14 46.35,45.09 24.89,45.09 21.34,41.53 21.34,35.31 18.92,32.89 17.6,32.89
D_CS
  Top 0.406: IC2.16 46.35,43.81 25.91,43.81 22.86,40.77 22.86,34.54 18.8,30.48 17.6,30.48 TFT.20
D_DIN
  Top 0.406: 46.99,42.55 IC2.18 26.91,42.53 24.38,40.01 24.38,33.66 18.56,27.83 TFT.22
D_OUT  (via drill 0.3)
  Top 0.406: v36.83,13.97 43.18,13.97 43.81,13.34 46.35,13.34 IC5.3 | v28.57,22.23 18.03,22.23 TFT.26
  Bottom 0.406: v28.57,22.23 v36.83,13.97
D_PENIRQ  (via drill 0.3)
  Top 0.406: v58.42,12.06 52.07,12.06 IC5.16
  Bottom 0.406: U1.D2 v58.42,12.06
D_PENIRQ_TFT  (via drill 0.3)
  Top 0.406: v39.37,12.7 IC5.4 | v39.37,20.32 17.78,20.32 TFT.28
  Bottom 0.406: v39.37,20.32 v39.37,12.7
DB8  (via drill 0.3)
  Top 0.406: v13.84,46.86 18.29,46.86 19.05,47.62 20.45,47.62 21.08,46.99 46.35,46.99 IC2.11
  Bottom 0.406: v13.84,46.86 13.34,46.35 13.34,39.37 14.61,38.1 TFT.13
DB9
  Top 0.406: TFT.15 15.24,35.56 16.38,36.7 18.29,36.7 19.81,38.23 19.81,42.29 23.88,46.35 46.35,46.35 IC2.12
DB10
  Top 0.406: IC2.13 24.4,45.73 20.57,41.91 20.57,35.69 19.05,34.16 16.2,34.16 TFT.17
DB11
  Top 0.406: IC2.15 25.43,44.48 22.1,41.15 22.1,34.92 18.8,31.62 16.2,31.62 TFT.19
DB12
  Top 0.406: TFT.21 15.24,27.94 16.38,29.08 18.67,29.08 23.62,34.04 23.62,40.39 26.42,43.18 IC2.17
DB13
  Top 0.406: TFT.23 15.24,24.77 16,24 19.43,24 19.81,23.62 66.8,23.62 67.94,24.77 73.16,24.77 IC3.18
DB14
  Top 0.406: TFT.25 14.61,22.86 13.34,24.13 13.34,25.4 14.48,26.54 18.67,26.54 20.57,24.64 66.55,24.64 67.31,25.4 IC3.17
DB15  (via drill 0.3)
  Top 0.406: IC3.12 73.05,28.57 69.22,28.57 66.17,25.53 21.46,25.53 v20.45,26.54
  Bottom 0.406: v20.45,26.54 14.35,26.54 13.34,25.53 13.34,21.59 14.61,20.32 TFT.27
GND  (via drill 0.3, 0.41, 0.5, 0.6)  (4 unrouted)
  Top 0.254: v46.35,60.96 46.23,60.83 46.23,60.2 46.74,60.2
  Top 0.305: 47.96,14.65 48.01,14.61 | 47.98,14 48.01,13.97 | 47.91,11.4 48.01,11.3 | 47.96,10.75 48.01,10.79 | 47.99,10.14 48.01,10.16 | 47.98,9.49 48.01,9.53 | 47.96,8.85 48.01,8.89 | 55.85,14 v56.52,13.97 v61.59,13.97 | IC4.9 77.57,18.45 v77.34,18.67 77.34,18.92 77.47,19.05 79.08,19.05 IC4.10 | 77.09,25.4 76.96,25.53 | 76.98,26.05 76.96,26.04 | 76.99,26.7 76.96,26.67 | 77.04,27.35 76.96,27.43
  Top 0.406: C13.1 50.2,69 50.93,69.72 50.93,72.52 U$7.GND@0 52.07,74.68 51.56,75.18 49.28,75.18 47.75,73.66 U$1.GND | PWR1.C v24.13,3.56 | IC4.1 80.69,13.29 v81.28,12.7 | IC2.1 52.45,41.02 52.07,40.64 v49.78,42.04 49.63,41.88 IC2.19 | IC2.10 52.12,47.03 v51.31,46.99 57.15,46.99 | IC4.19 68.61,13.94 v68.07,14.61 67.31,15.24 48.26,15.24 48.01,14.99 | v5.84,27.18 v5.84,28.45 | v5.84,28.45 v5.84,29.72 v5.84,30.99 5.84,31.75 | v5.84,28.45 7.53,28.45 R10.1 | IC1.GND 5.21,32.38 5.84,31.75 | 5.84,31.75 v5.84,33.53 5.84,33.78 IC1.GND1 | IC1.GND1 6.6,34.29 v7.11,34.8 | v7.11,32.26 6.35,32.26 5.84,31.75 | IC1.GND1 v7.11,33.53 v5.84,34.8 v7.11,36.07 v5.84,36.07 v5.84,37.34 v5.84,38.61 | v5.84,38.61 v7.11,38.61 v7.11,37.34 | v5.84,38.61 v5.84,39.88 | v5.84,39.88 v4.57,39.88 v3.3,39.88 v3.3,41.15 v4.57,41.15 | v5.84,39.88 v5.84,41.15 v7.11,41.15 v7.11,39.88 | IC5.19 55.85,14 55.91,14 | 54.29,36.51 56.13,38.35 v56.9,38.35 v60.71,38.35 | IC3.1 77.39,23.45 76.96,23.88 | 76.96,23.88 76.96,25.53 76.96,26.04 76.96,26.67 76.96,27.43 76.96,28.96 | 76.96,28.96 77.09,29.46 78.95,29.46 IC3.10 | 76.96,23.88 75.18,23.88 74.93,24.13 73.31,24.13 IC3.19 70.33,24.1 v69.09,22.86 | IC5.1 47.96,14.65 | IC5.2 47.98,14 | IC5.6 47.91,11.4 | IC5.7 47.96,10.75 | IC5.8 47.99,10.14 | IC5.9 47.98,9.49 | IC5.10 47.96,8.85 | IC3.4 77.09,25.4 | IC3.5 76.98,26.05 | IC3.6 76.99,26.7 | IC3.7 77.04,27.35 | IC3.9 77.31,28.61 76.96,28.96 | v11.68,68.58 PWR.C | 86.23,66.04 v83.31,66.04 C3.- 80.14,66.07 80.14,67.31 79.5,67.94 75.56,67.94 74.55,68.96 74.55,70.1 | C14.1 73.44,69 74.55,70.1 | 74.55,70.1 74.55,73.28 U$6.GND@0 | v81.53,59.31 81.53,58.67 81.79,58.42 R5.2
  Top 0.406: C4.- v64.77,66.04 | v39.37,54.61 v58.67,54.61 64.26,54.61 66.17,52.7 66.17,49.02 64.14,46.99 57.15,46.99 | 29.21,73.79 U$1.GND@0 | 3.86,60.17 J1.2 | 86.36,66.04 90.17,69.85 U$6.GND | v65.15,77.47 66.04,77.47 | v57.15,47.37 57.15,46.99 | v43.18,78.74 43.18,77.47
  Top 0.61: 41.91,5.08 43.68,5.08 46.6,8.01 47.63,8.01 48.01,8.38 48.01,8.89 48.01,9.53 48.01,10.16 48.01,10.79 48.01,11.3 48.01,13.97 48.01,14.61 48.01,14.99 | v29.21,48.26 26.67,50.8 U1.GND@2 26.42,50.55 24.13,48.26 22.86,48.26 20.32,50.8 17.6,50.8 TFT.4 | TFT.4 TFT.6 | TFT.4 TFT.2 TFT.1 | v7.62,53.34 8.65,53.34 9.53,52.46 | 11.38,77.55 v12.19,78.49 12.92,77.76 D13.C | v24.13,69.22 22.52,68.62 C6.1 | SER1.1 26.04,75.56 27.43,75.56 29.21,73.79
  Top 0.813: U1.GND@1 41.91,2.54 | 41.91,2.54 U1.GND@0 | v37.34,7.11 39.88,7.11 41.91,5.08 41.91,2.54 | 4.06,11.43 C12.- 3.3,10.29 2.54,9.53 2.54,6.87 C7.2 | v11.43,41.91 R7.1 | C9.2 v7.62,44.45 7.62,45.72 9.53,47.63 C11.- 9.53,52.46 11.18,54.1 11.18,55.86 C10.1 | 7.62,77.47 8.89,77.47 | 8.89,77.47 8.89,69.6 | 8.89,69.6 7.37,69.6 7.62,69.85 | 11.43,77.47 8.89,77.47 | 8.89,68.58 8.89,69.6
  Top 1.016: v68.58,8.89 v81.28,8.89 | 8.66,60.17 11.18,57.66 11.18,55.9 C10.1 | 3.81,64.02 J1.2 | 9.17,68.58 v11.68,68.58 | C1.- v34.54,66.04 v39.37,66.04
  Top 1.422: v67.31,66.04 v64.77,66.04 | 52.07,40.64 52.07,37.47 53.34,37.47 54.29,36.51 60.33,30.48 v69.09,30.48 69.22,30.48
  Top 1.676: 77.47,19.05 77.47,20.32 76.2,21.59 76.2,31.75
  Bottom 0.406: TFT.14 TFT.16 | U$7.GND 68.2,73.66 70.1,71.75 73.03,71.75 U$6.GND@0 | v81.53,59.31 81.53,60.2 81.28,60.45 81.28,64.01 v83.31,66.04 | v64.77,66.04 62.87,64.14 60.33,64.14 58.42,62.23 58.42,60.07 58.67,59.82 v58.67,54.61 | v65.15,77.47 63.88,78.74 63.88,78.61 53.47,78.74 52.07,77.09 U$7.GND@0 | v49.78,42.04 49.78,45.47 v51.31,46.99 | v43.18,78.74 30.48,78.74 29.34,77.6 29.34,73.66 U$1.GND@0 | 21.84,69.22 21.84,63.5 18.92,60.58 18.92,58.67 21.34,56.26 21.84,56.26 24,54.1 24,53.21 U1.GND@2
  Bottom 0.61: v29.21,48.26 v29.21,41.27 | TFT.6 TFT.8 TFT.10 TFT.12 TFT.14 | TFT.1 7.73,53.23 v7.62,53.34 | v24.13,69.22 21.84,69.22 SER2.1 SER1.1
  Bottom 0.813: v37.34,7.11 34.29,7.11 31.75,4.57 25.15,4.57 v24.13,3.56 22.86,4.83 v22.86,7.62 | v7.11,41.15 5.08,43.18 6.35,44.45 v7.62,44.45 8.89,44.45 v11.43,41.91 | U$1.GND 44.45,71.12 v39.37,66.04
  Bottom 1.016: v77.34,18.67 v81.28,12.7 v81.28,8.89 82.55,7.62 U1.GND@3 | v69.09,22.86 v69.09,30.48
  Bottom 1.27: v68.58,8.89 51.56,8.89 47.24,4.57 43.94,4.57 43.43,4.06 43.43,2.79 U1.GND@1 | U1.GND@4 U1.GND@3
  Bottom 1.422: U$7.GND v67.31,66.04
  other vias: 5.84,32.26 48.26,54.61 23.5,54.74 67.56,48.01 65.02,48.01 67.56,54.36 25.4,29.84 30.48,29.84 40.64,29.84 34.29,38.73 44.45,38.73 52.07,38.73 40.64,29.84 33.02,22.23 39.37,22.23 44.45,22.23 50.8,22.23 60.96,22.23 87.63,78.74 53.34,63.5 45.72,66.04 10.16,46.99 7.62,46.99 5.08,46.99 6.35,22.86 6.35,17.78 2.54,16.51 8.89,16.51 2.54,8.89 11.43,7.62 6.35,2.54
  pour Top (isolate 0.61, hatched): 99.57,77.85 99.57,2.29 97.92,0.38 16.76,0.38 16.51,50.8 0.38,51.44 0.13,63.5 8.89,67.31 8.89,80.01 97.92,80.9
  pour Bottom (isolate 0.305, hatched): 99.57,77.47 99.69,2.16 98.04,0.25 97.03,0.25 16.38,0.38 16.51,50.8 0.38,51.94 0,67.31 1.27,67.31 1.27,80.01 10.16,80.01 97.92,82.17 99.44,77.98
  pour Top (isolate 0.406): 0.38,45.72 0.51,13.97 10.16,13.97 10.16,10.16 0,10.16 0.38,7.24 0.38,0.38 16.38,0.38 16.51,50.8
  pour Bottom (isolate 0.406): 0.38,50.8 16.51,50.8 15.62,0.38 2.16,0.38 -0.89,8.51
LED  (via drill 0.3)
  Top 0.305: v27.94,64.01 20.32,64.01 18.76,65.56 RN2.8
  Bottom 0.406: v27.94,64.01 27.94,51.44 28.57,50.8 U1.D13
N$1
  Top 0.406: U$6.SLP U$6.RST
N$2
  Top 0.305: 14.61,68.17 PWR.A 15.11,68.49 15.11,67.69 14.44,67.02 RN2.4
  Top 0.406: 14.61,68.58 PWR.A
N$3
  Top 0.406: U$6.MS1 76.2,62.23 85.72,62.23 86.36,61.59 86.36,59.69 85.09,58.42 R5.1
  Bottom 0.406: U$6.MS1 SJ1.2
N$4
  Top 1.422: A-MOT1.1 U$1.2B
  Bottom 1.422: A-MOT2.1 31.75,72.39 U$1.2B
N$5
  Top 1.422: A-MOT1.2 U$1.2A 34.29,71.12 A-MOT2.2
N$6
  Top 1.422: A-MOT1.3 U$1.1A 36.83,73.03 37.47,73.03 37.47,71.12 A-MOT2.3
N$7
  Top 1.422: A-MOT1.4 U$1.1B
  Bottom 0.406: 40.64,71.12 A-MOT2.4
  Bottom 1.422: 40.64,71.12 39.37,72.39 U$1.1B
N$8
  Top 0.406: U$1.SLP U$1.RST
N$9  (via drill 0.3)
  Top 0.406: v29.21,64.01 34.29,64.01 35.31,62.99 44.32,62.99 45.59,61.72 45.59,59.31 45.72,59.18 46.16,59.18 RN1.1
  Bottom 0.406: v29.21,64.01 U$1.MS1 SJ7.2
N$10
  Bottom 0.406: U$6.MS2 SJ2.2
N$11
  Bottom 0.406: U$1.MS2 SJ8.2
N$12
  Bottom 0.406: U$6.MS3 SJ5.2
N$13
  Top 0.406: U$7.SLP U$7.RST
N$14
  Bottom 0.406: U$1.MS3 SJ9.2
N$15
  Top 0.305: RN2.2 15.49,67.05 16.38,67.94 16.38,69.22 15.75,69.85 14.61,69.85 13.97,70.48 13.97,72.39 12.92,73.44 RX_LED.C
N$16
  Top 0.152: 14.99,66.17 14.86,66.04 13.84,66.04
  Top 0.203: RN2.3 14.99,66.17
  Top 0.254: 13.21,70.83 TX_LED.C
  Top 0.305: 13.21,70.83 13.21,70.23 13.97,69.34 13.97,67.56 13.46,67.06 13.46,66.42 13.84,66.04
N$17
  Bottom 0.406: U$7.MS2 SJ4.2
N$18  (via drill 0.3)
  Top 0.254: v44.45,64.77 47.75,61.47 47.75,60.2 RN1.5
  Top 0.305: B_STP.A 68.36,78.45 67.94,78.99 48.39,78.99 v47.62,78.23
  Bottom 0.254: v47.62,78.23 47.62,72.01 44.2,68.45 44.2,65.02 v44.45,64.77
N$19  (via drill 0.3)
  Top 0.203: RN1.6 47.24,61.22
  Top 0.254: v46.48,77.47 A_STP.A | 47.24,61.22 44.45,64.01 v43.18,64.01
  Bottom 0.254: v43.18,64.01 43.18,68.33 46.48,71.63 v46.48,77.47
N$20  (via drill 0.3)
  Top 0.305: RN2.1 18.89,66.52 v20.32,67.94
  Top 0.406: D13.A 19.56,76.2 v20.32,75.44
  Bottom 0.406: v20.32,75.44 v20.32,67.94
N$21
  Bottom 1.422: C-MOT1.1 U$6.2B 77.47,72.39 C-MOT2.1
N$22
  Top 1.422: U$6.2A 80.01,71.12 C-MOT2.2
  Bottom 1.422: U$6.2A C-MOT1.2
N$23
  Top 0.305: C_STP.A 91.22,78.01 90.93,77.72 89.53,77.72 89.28,77.47 89.28,76.26 R3.1
N$24  (1 unrouted)
  Top 0.813: R9.2 10.16,26.92 11.43,25.53 | L1.2 | 10.08,11.35 C12.+ 7.37,9.14 6.22,8 6.22,4.95 | C7.1 6.22,4.95 | 6.22,4.95 ON_BOARD_PWR.2 | 26.42,4.57 22.1,4.57 20.07,2.54 13.08,2.54 ON_BOARD_PWR.1 | 26.42,4.57 R12.1 | D2.A 25.89,5.1 26.42,4.57
  Top 1.016: 11.43,20.45 L1.2 | 10.08,11.35 11.35,11.35 11.43,12.32 11.43,20.45 | 11.43,20.45 11.43,25.4
  Bottom 0.813: ON_BOARD_PWR.2 ON_BOARD_PWR.1
N$25
  Top 0.406: 28.89,2.64 PWR1.A
  Top 0.813: R12.2 28.89,2.64
N$26
  Bottom 0.406: 83.19,71.12 C-MOT2.3
  Bottom 1.422: C-MOT1.3 U$6.1A 82.55,71.75 83.19,71.12
N$27
  Bottom 1.422: C-MOT1.4 U$6.1B 85.09,72.39 86.36,71.12 C-MOT2.4
N$28
  Top 1.422: B-MOT1.1 U$7.2B
  Bottom 1.422: B-MOT2.1 54.61,72.39 U$7.2B
N$29
  Top 1.422: B-MOT1.2 U$7.2A 57.15,71.12 B-MOT2.2
N$30
  Top 1.422: B-MOT1.3 U$7.1A
  Bottom 0.406: 59.69,71.75 60.33,71.12
  Bottom 1.422: U$7.1A 59.69,71.75 | 60.33,71.12 B-MOT2.3
N$31
  Bottom 0.406: U$7.MS3 SJ6.2
N$32
  Top 0.61: 8.95,30.12 8.89,30.06
  Top 0.813: R10.2 8.89,30.06 R9.1 | IC1.FB 8.95,30.12
N$33
  Top 0.152: 50.8,59.69 46.74,59.69 RN1.2
  Top 0.203: RN1.2
  Top 0.406: 50.8,59.69 U$7.MS1
  Bottom 0.406: SJ3.2 U$7.MS1
N$34  (via drill 0.3)
  Top 0.406: 3.81,44.45 R4.2
  Top 0.61: 3.81,44.45 5.71,42.55 v7.62,42.55 | IC1.EN 10.03,34.92 10.67,35.56 10.67,36.83 9.91,37.59 9.91,40.26 v9.53,40.64
  Bottom 0.61: v9.53,40.64 v7.62,42.55
N$35
  cutout Top (no thermals): 45.72,16.51 52.07,16.51 52.07,8.51 45.72,8.51
  cutout Top (no thermals): 73.79,20.07 80.14,20.07 80.14,12.06 73.79,12.06
  cutout Top (no thermals): 72.64,30.61 80.01,30.61 80.01,22.61 72.64,22.61
  cutout Top (no thermals): 45.85,48.26 53.21,48.26 53.21,40.26 45.85,40.26
N$36
  Top 1.422: B-MOT1.4 U$7.1B
  Bottom 1.422: U$7.1B 62.23,72.39 63.5,71.12 B-MOT2.4
N$38
  Top 0.406: 10.79,44.45 C9.1
  Top 0.61: 10.79,44.45 10.79,43.56 8.13,40.89 8.13,38.1 8.89,37.34 8.89,36.26 IC1.SS
N$40  (via drill 0.41)
  Top 0.61: R7.2 11.43,38.35 11.68,37.85 v11.68,37.08 | C5.2 11.43,31.5 v11.68,30.48
  Bottom 0.61: v11.68,30.48 v11.68,37.08
N$42
  Top 0.61: IC1.COMP 11.06,33.66 C5.1
N$43  (via drill 0.41)
  Top 0.61: IC1.BS 3.75,37.53 v3.81,37.59 | v3.81,30.48 3.81,29.19 C8.1
  Bottom 0.61: v3.81,37.59 v3.81,30.48
N$44
  Top 0.61: C8.2 2.52,26.94 | 3.56,20.71 L1.1
  Top 0.813: IC1.SW 1.91,33.66 1.27,33.02 1.27,28.19 2.52,26.94
  Top 1.016: 3.56,20.71 2.28,20.71 2.03,23.5 2.03,26.19 2.52,26.94
RESET  (via drill 0.6)
  Top 0.305: 2.38,69.69 S2.4
  Top 0.813: S2.3 1.94,77.64 1.27,76.96 1.27,69.85 | 1.27,69.85 v1.65,68.58 | 2.38,69.69 1.44,69.69 1.27,69.85
  Bottom 0.813: U1.RES 31.75,1.27 5.08,1.27 0.89,5.84 0.89,67.84 v1.65,68.58
SCL
  Top 0.406: U1.D21 JP3.2
SDA
  Top 0.406: U1.D20 JP3.1
SERV1  (via drill 0.3)
  Top 0.406: v30.48,52.83 v39.12,52.83
  Bottom 0.406: v30.48,52.83 30.48,67.06 27.94,69.6 27.94,74.3 26.04,76.2 19.68,76.2 19.05,75.56 SER1.3 | v39.12,52.83 U1.D9
SERV2
  Bottom 0.406: U1.D10 35.31,49.53 22.86,49.53 21.59,50.8 21.59,54.61 17.78,58.42 17.78,69.85 SER2.3
SPI_MISO  (via drill 0.3)
  Top 0.406: v83.19,11.43 59.18,11.43 58.93,11.18 57.66,11.18 57.4,11.43 52.7,11.43 IC5.15
  Bottom 0.406: U1.D50 84.45,12.7 v83.19,11.43
SPI_MISO_TFT  (via drill 0.3)
  Top 0.406: v35.56,11.43 43.18,11.43 43.81,12.06 46.35,12.06 IC5.5 | v29.84,17.14 17.91,17.14 TFT.30
  Bottom 0.406: v29.84,17.14 v35.56,11.43
SPI_MOSI
  Top 0.305: 85.72,16.51 88.27,13.97 95.25,13.97
  Top 0.406: U1.D51 95.25,13.97 | 85.72,16.51 79.38,16.51 IC4.6
SPI_MOSI_TFT  (via drill 0.3)
  Top 0.406: v31.11,18.41 32.38,17.14 73.03,17.14 IC4.14 | v25.4,14.61 23.5,12.7 17.78,12.7 TFT.34
  Bottom 0.406: v31.11,18.41 29.21,18.41 v25.4,14.61
SPI_SCK
  Top 0.406: IC4.4 83.19,15.24 88.27,10.16 U1.D52
SPI_SCK_TFT
  Top 0.406: TFT.32 18.29,15.11 20.83,15.11 21.59,15.88 73.03,15.88 IC4.16
SPI_SS
  Top 0.406: U1.D53 95.25,11.43 88.27,11.43 83.82,15.88 79.38,15.88 IC4.5
SPI_SS_TFT  (via drill 0.3)
  Top 0.406: v22.86,18.41 29.84,18.41 31.75,16.51 73.03,16.51 IC4.15
  Bottom 0.406: v22.86,18.41 19.68,15.24 19.68,10.79 19.05,10.16 17.78,10.16 TFT.36
TFT_CS  (via drill 0.3)
  Top 0.406: v74.3,15.24 IC4.17 | v22.86,26.67 v62.87,26.67
  Bottom 0.406: TFT.29 16.26,18.92 18.29,18.92 19.05,19.68 19.05,22.86 v22.86,26.67 | v62.87,26.67 v74.3,15.24
TFT_LEDA
  Top 0.406: TFT.37 15.24,7.62 16.38,8.76 18.29,8.76 20.07,10.54 25.78,10.54 26.67,11.43 R26.2
TFT_RD
  Top 0.406: TFT.11 14.61,40.01 12.7,40.01 12.7,7.49 13.97,6.22 19.05,6.22 22.23,9.4 29.72,9.4 31.75,11.43 R13.2
TFT_REST  (via drill 0.3)
  Top 0.406: v21.59,18.41 22.86,19.68 31.11,19.68 33.02,17.78 73.03,17.78 IC4.13
  Bottom 0.406: TFT.33 15.24,12.7 16.38,13.84 18.29,13.84 19.05,14.61 19.05,15.88 v21.59,18.41
TFT_RS  (via drill 0.3)
  Top 0.406: v71.75,14.61 73.03,14.61 IC4.18 | v59.69,27.94 57.66,29.97 44.58,29.97 42.29,32.26 42.29,37.72 39.88,40.13 v39.5,40.13 | v19.81,46.48 19.81,45.72 18.41,44.32 16.24,44.32 TFT.7
  Bottom 0.406: v71.75,14.61 59.69,26.67 v59.69,27.94 | v39.5,40.13 26.16,40.13 v19.81,46.48
TFT_WR  (via drill 0.3)
  Top 0.406: v42.55,18.8 42.93,18.41 73.03,18.41 IC4.12 | TFT.9 14.95,42.84 16,41.78 18.29,41.78 19.05,42.55 19.05,43.18 v20.19,44.32
  Bottom 0.406: v42.55,18.8 42.55,22.23 25.78,38.86 20.32,44.32 v20.19,44.32
VCC  (via drill 0.3, 0.6)
  Top 0.305: 14.99,71.09 TX_LED.A | RN2.5 13.73,64.91 v13.72,62.23
  Top 0.406: 30.48,7.62 D2.C | 52.7,14.61 IC5.20 50.21,14.61 50.04,14.48 49.53,13.97 | Y-MAX.2 95.25,62.23 | 88.65,56.9 89.03,56.9 | 89.03,56.9 94.11,56.9 96.52,54.48 U1.5V@2 | R18.1 89.15,57.02 89.03,56.9 | Y-MIN.2 X-MIN.2 97.79,71.12 98.55,70.36 98.55,67.44 97.79,66.67 95.89,66.67 95.25,66.04 95.25,62.23 | X-MAX.2 95.25,62.23 | v16,71.12 16,73.41 15.88,73.53 15.15,73.53 RX_LED.A | R19.1 54.29,56.83 | 54.29,56.83 54.1,56.64 | 31.37,56.64 24.45,56.7 30.48,56.7 | 30.48,56.7 31.69,56.7 v31.75,56.64 31.43,56.96 R2.1 | 54.29,56.83 54.42,56.83 v54.61,56.64 | v29.21,56.64 30.42,56.64 30.48,56.7
  Top 0.61: 48.26,1.02 48.26,6.35 49.53,7.62 49.53,13.97
  Top 0.813: 38.1,1.02 31.5,1.02 30.61,1.91 30.48,1.91 30.48,7.62 | U$6.VDD 87.63,74.68 87.12,75.18 87.12,77.22 85.85,78.49 76.2,78.49 75.18,77.47 75.18,75.44 74.93,75.18 66.29,75.18 U$7.VDD 64.01,74.42 64.01,77.22 63.12,78.11 49.4,78.11 48.77,77.47 48.77,75.95 47.75,74.93 41.91,74.93 U$1.VDD 41.66,73.91 41.66,77.47 40.64,78.49 22.61,78.49 21.59,77.47 SER1.2 SER2.2 21.59,70.23 20.7,69.34 17.78,69.34 v16,71.12 TX_LED.A | U1.5V@1 U1.5V@2 | 88.65,56.9 v80.01,56.9 v77.47,56.9 v74.93,56.9 72.9,56.87 71.88,56.64 v57.15,56.64 v54.61,56.64 54.1,56.64 v52.07,56.64 v34.29,56.64 v31.75,56.64 31.37,56.64 v29.21,56.64 14.48,56.64 | TFT.3 14.84,50.69 12.7,52.83 12.7,54.86 14.48,56.64 | 38.1,1.27 38.1,1.02 | 38.1,1.02 48.26,1.02 97.54,1.02 98.68,2.16 v98.68,4.95 | 14.48,56.64 13.21,57.91 13.21,60.83 13.72,61.34 v13.72,62.23
  Top 1.27: U1.5V@0 38.1,1.27
  Bottom 0.406: 34.29,57.78 SJ9.1 | U$6.VDD 90.17,71.12 Y-MIN.2 | SJ7.1 v29.21,56.64 | v31.75,56.64 SJ8.1 31.81,57.97 SJ9.1 | SJ9.1 v34.29,56.64 | SJ3.1 v52.07,56.64 | SJ4.1 v54.61,56.64 | SJ6.1 v57.15,56.64 | SJ1.1 v74.93,56.9 | SJ2.1 v77.47,56.9 | SJ5.1 v80.01,56.9
  Bottom 0.813: v98.68,4.95 98.68,48.9 U1.5V@2 | v16,71.12 13.08,68.07 13.08,66.8 13.72,65.79 v13.72,62.23
X-MAX  (via drill 0.3)
  Top 0.406: v93.34,53.34 91.82,51.82 91.82,49.91 89.15,47.24 77.22,47.24 76.2,48.26 U1.D17 | X-MAX.3 99.06,64.77 99.06,59.05 v96.9,56.9
  Bottom 0.406: v93.34,53.34 v96.9,56.9
X-MIN  (via drill 0.3)
  Top 0.406: v93.34,54.61 92.33,54.61 91.95,54.99 77.72,54.99 U1.D16
  Bottom 0.406: v93.34,54.61 94.61,56.01 98.17,59.56 98.17,72.01 X-MIN.3
Y-MAX
  Bottom 0.406: U1.D15 71.12,61.72 77.98,68.58 83.82,68.58 87.63,64.77 Y-MAX.3
Y-MIN  (via drill 0.3)
  Top 0.406: U1.D14 73.66,55.88 v93.34,55.88
  Bottom 0.406: Y-MIN.3 95.25,72.39 95.25,57.78 v93.34,55.88

### Text on the board
tValues: C1 | C4 | 100uF | 100uF | 1k | R2 | R19 | 10k | 10k | 10k | 1k | 1k | R18 | 3v3 | 3v3 | 3v3 | 5v
_tsilk: pen lift | + | + | + | + | S | + | - | + | + | + | Polarshield v2.4 / www.polargraph.co.uk / 2016.03.30 | GND | LED | D-CS | D-CLK | SER2 | SER1 | B-DIR | B-STEP | B-EN | A-DIR | A-STEP | A-EN | PENIRQ | TX | RX | Y-MIN | Y-MAX | X-MIN | X-MAX | D-DIN | D-OUT | VCC | AREF | GND | 13 | 12 | 11 | 10 | 9 | 8 | 7 | 6 | 5 | 4 | 3 | 2 | 1 | 0 | 14 | 15 | 16 | 17 | 18 | 19 | 20 | SDA | 21 | SCL | DB8 DB9 | 22 23 | DB10 DB11 | 24 25 | DB12 DB13 | 26 27 | DB14 DB15 | 28 29 | C-EN C-STEP | 30 31 | C-DIR | 32 | 33 | 34 35 | 36 37 | TFT RS WR | 38 39 | TFT CS REST | 40 41 | 42 | 43 | 44 | 45 | Polarshield v2.4 / An open source / art project. / www.polargraph.co.uk / 2016.03.30 | 46 | 47 | 48 | 49 | MISO MOSI | 50 51 | 10 | 10 | SCK SS | 52 53 | A0 | A1 | A2 | A3 | A4 | A5 | A6 | A7 | A8 | A9 | A10 | A11 | A12 | A13 | A14 | A15 | GND | RESET | 3V3 | 5V | GND | VIN | +
_bsilk: MIN | limits | Y | X | servo | S1 | S2 | +V | +V | S | G | G | MOTOR A | MOTOR B | MOTOR C | MAX | +V | G | Polarshield v2.4 | www.polargraph.co.uk